# Altium schematic sheet RGBMainBoard - SCH.SchDoc
size A3; SheetNumber: 2; SheetTotal: 9
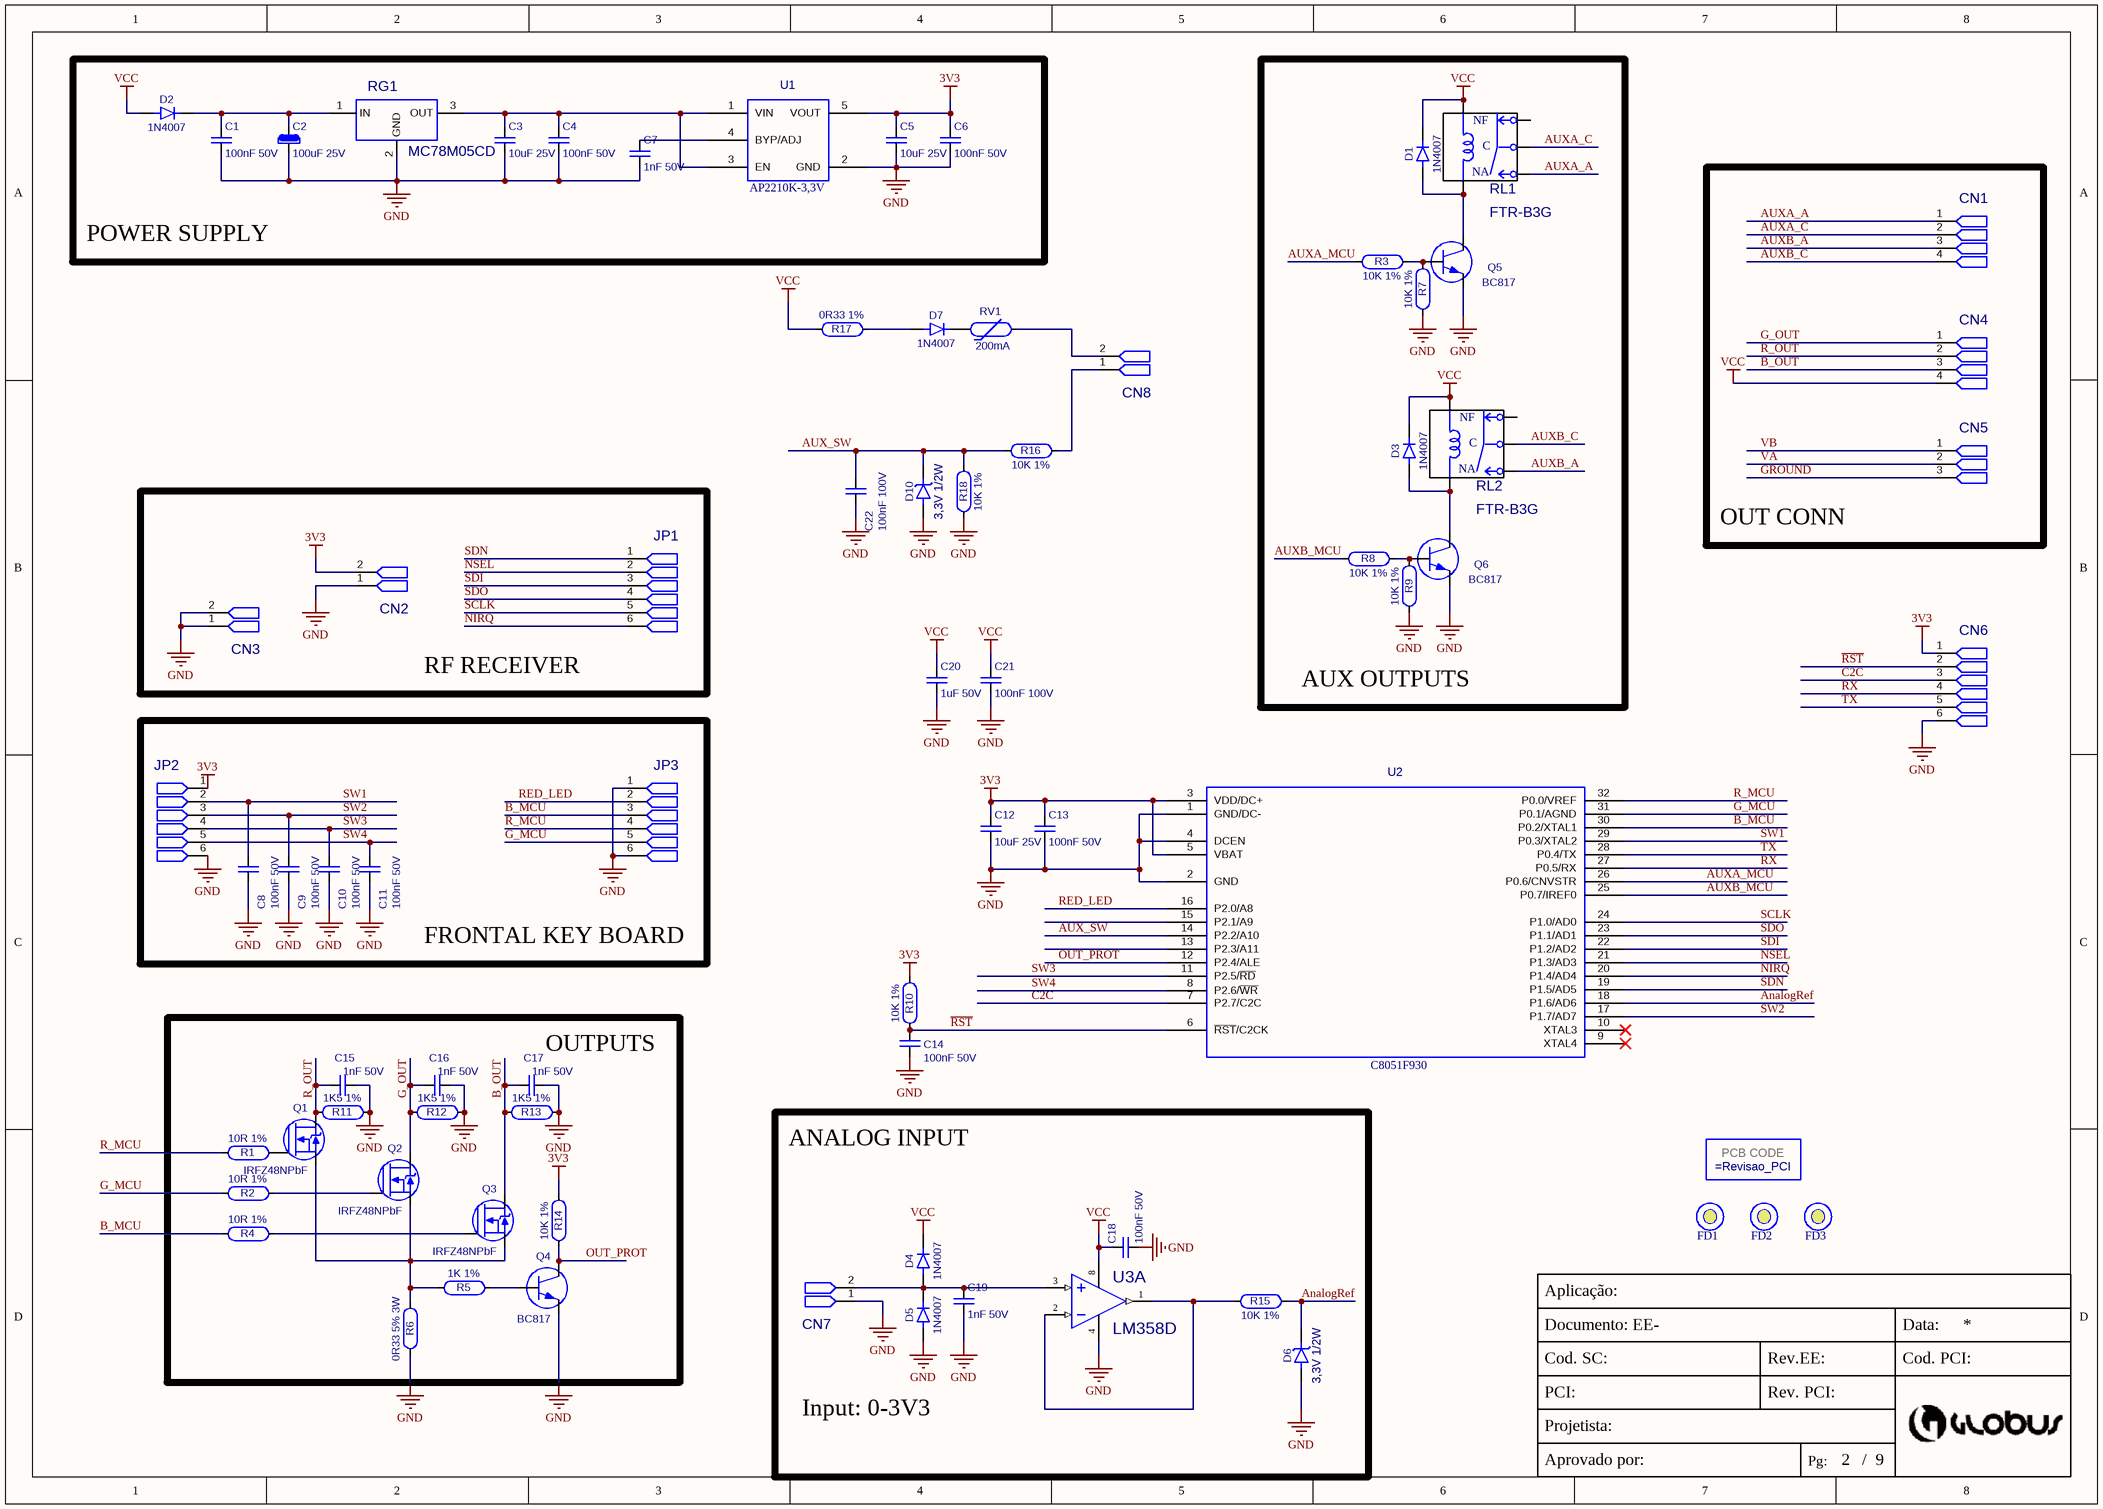
[diagram p0: RGBMainBoard - SCH.SchDoc]

## Parts
=Revisao_PCI  *  [NULL_FOOTPRINT]  (value not drawn)
C1  100nF 50V  [C0805]
C2  100uF 25V  [CAP100P_D6.3H11]
C3  10uF 25V  [C1206]
C4  100nF 50V  [C0805]
C5  10uF 25V  [C1206]
C6  100nF 50V  [C0805]
C7  1nF 50V  [C0805]
C8  100nF 50V  [C0805]
C9  100nF 50V  [C0805]
C10  100nF 50V  [C0805]
C11  100nF 50V  [C0805]
C12  10uF 25V  [C1206]
C13  100nF 50V  [C0805]
C14  100nF 50V  [C0805]
C15  1nF 50V  [C0805]
C16  1nF 50V  [C0805]
C17  1nF 50V  [C0805]
C18  100nF 50V  [C0805]
C19  1nF 50V  [C0805]
C20  1uF 50V  [C0805]
C21  100nF 100V  [C1206]
C22  100nF 100V  [C1206]
CN1  BORNE 4P 5.08  [BORNE 4P 5.08 PTH]  (value not drawn)
CN2  CON BARRA 1x2 180 MACHO PTH  [BARRA2PM180]  (value not drawn)
CN3  CON BARRA 1x2 180 MACHO PTH  [BARRA2PM180]  (value not drawn)
CN4  BORNE 4P 5.08  [BORNE 4P 5.08 PTH]  (value not drawn)
CN5  BORNE 3P 5.08  [BORNE 3P 5.08 PTH]  (value not drawn)
CN6  CON BARRA 1x6 180 MACHO PTH  17mm  [BARRA1x6PM180-17mm]  (value not drawn)
CN7  CON BARRA 1x2 180 MACHO PTH  [BARRA2PM180]  (value not drawn)
CN8  CON BARRA 1x2 180 MACHO PTH  [BARRA2PM180]  (value not drawn)
D1  1N4007  [DO214AC-SMA]
D2  1N4007  [DO214AC-SMA]
D3  1N4007  [DO214AC-SMA]
D4  1N4007  [DO214AC-SMA]
D5  1N4007  [DO214AC-SMA]
D6  3,3V 1/2W  [SOD80-MINIMELF]
D7  1N4007  [DO214AC-SMA]
D10  3,3V 1/2W  [SOD80-MINIMELF]
FD1  Fiducial  [Fiducial]  (value not drawn)
FD2  Fiducial  [Fiducial]  (value not drawn)
FD3  Fiducial  [Fiducial]  (value not drawn)
JP1  CON BARRA 1x6 180 MACHO PTH  [BARRA6PM180]  (value not drawn)
JP2  BARRA6PF180  [BARRA6PF180]  (value not drawn)
JP3  BARRA6PF180  [BARRA6PF180]  (value not drawn)
Q1  IRFZ48NPbF  [TO220AB]
Q2  IRFZ48NPbF  [TO220AB]
Q3  IRFZ48NPbF  [TO220AB]
Q4  BC817  [SOT23]
Q5  BC817  [SOT23]
Q6  BC817  [SOT23]
R1  10R 1%  [R0805]
R2  10R 1%  [R0805]
R3  10K 1%  [R0805]
R4  10R 1%  [R0805]
R5  1K 1%  [R0805]
R6  0R33 5% 3W  [RES2W_L16mm_D5.5]
R7  10K 1%  [R0805]
R8  10K 1%  [R0805]
R9  10K 1%  [R0805]
R10  10K 1%  [R0805]
R11  1K5 1%  [R0805]
R12  1K5 1%  [R0805]
R13  1K5 1%  [R0805]
R14  10K 1%  [R0805]
R15  10K 1%  [R0805]
R16  10K 1%  [R0805]
R17  0R33 1%  [R1206]
R18  10K 1%  [R0805]
RG1  MC78M05CD  [DPAK]
RL1  value FTR-B3G  [RELE_HF3FF-SERIE]  (hidden comment: RELE 12V HF3FF/012-1ZST)
RL2  value FTR-B3G  [RELE_HF3FF-SERIE]  (hidden comment: RELE 12V HF3FF/012-1ZST)
RV1  value 200mA  [PTC5.1_7.4X3.1mm]  (hidden comment: 60R020XU)
U1  AP2210K-3,3V  [SOT23_5]
U2  C8051F930  [LQFP32 7X7]
U3  LM358D  [SO8]  (part A of 2)

## Blocks framed on the sheet
POWER SUPPLY: C1-C7 D2 RG1 U1
AUX OUTPUTS: D1 D3 Q5 Q6 R3 R7-R9 RL1 RL2
OUT CONN: CN1 CN4 CN5
RF RECEIVER: CN2 CN3 JP1
FRONTAL KEY BOARD: C8-C11 JP2 JP3
OUTPUTS: C15-C17 Q1-Q4 R1 R2 R4-R6 R11-R14

## Nets
3V3: C5.1 C6.1 C12.1 C13.1 CN2.2 CN6.1 JP2.1 R10.2 R14.2 U1.5(VOUT) U2.3(VDD/DC+) U2.5(VBAT)
GND: C1.2 C2.1(negative) C3.2 C4.2 C5.2 C6.2 C7.2 C8.2 C9.2 C10.2 C11.2 C12.2 C13.2 C14.2 C15.2 C16.2 C17.2 C18.2 C19.2 C20.2 C21.2 C22.2 CN2.1 CN3.1 CN3.2 CN6.6 CN7.1 D5.1(anode) D6.1(anode) D10.1(anode) JP2.6 JP3.1 JP3.6 Q4.3(E) Q5.3(E) Q6.3(E) R6.1 R7.1 R9.1 R11.2 R12.2 R13.2 R18.2 RG1.2(GND) U1.2(GND) U2.1(GND/DC-) U2.2(GND) U2.4(DCEN) U3.4(GND)
VCC: C18.1 C20.1 C21.1 CN4.4 D1.2(cathode) D2.1(anode) D3.2(cathode) D4.2(cathode) R17.1 RL1.1(B1) RL2.1(B1) U3.8(V+)
AnalogRef: D6.2(cathode) R15.1 U2.18(P1.6/AD6)
AUX_SW: C22.1 D10.2(cathode) R16.2 R18.1 U2.14(P2.2/A10)
AUXA_A: CN1.1 RL1.4(NA)
AUXA_C: CN1.2 RL1.3(C)
AUXA_MCU: R3.2 U2.26(P0.6/CNVSTR)
AUXB_A: CN1.3 RL2.4(NA)
AUXB_C: CN1.4 RL2.3(C)
AUXB_MCU: R8.2 U2.25(P0.7/IREF0)
B_MCU: JP3.3 R4.1 U2.30(P0.2/XTAL1)
B_OUT: C17.1 CN4.3 Q3.2(D) R13.1
C2C: CN6.3 U2.7(P2.7/C2C)
G_MCU: JP3.5 R2.1 U2.31(P0.1/AGND)
G_OUT: C16.1 CN4.1 Q2.2(D) R12.1
GROUND: CN5.3
NIRQ: JP1.6 U2.20(P1.4/AD4)
NSEL: JP1.2 U2.21(P1.3/AD3)
OUT_PROT: Q4.2(C) R14.1 U2.12(P2.4/ALE)
~{RST}: C14.1 CN6.2 R10.1 U2.6(~{RST}/C2CK)
R_MCU: JP3.4 R1.1 U2.32(P0.0/VREF)
R_OUT: C15.1 CN4.2 Q1.2(D) R11.1
RED_LED: JP3.2 U2.16(P2.0/A8)
RX: CN6.4 U2.27(P0.5/RX)
SCLK: JP1.5 U2.24(P1.0/AD0)
SDI: JP1.3 U2.22(P1.2/AD2)
SDN: JP1.1 U2.19(P1.5/AD5)
SDO: JP1.4 U2.23(P1.1/AD1)
SW1: C8.1 JP2.2 U2.29(P0.3/XTAL2)
SW2: C9.1 JP2.3 U2.17(P1.7/AD7)
SW3: C10.1 JP2.4 U2.11(P2.5/~{RD})
SW4: C11.1 JP2.5 U2.8(P2.6/~{WR})
TX: CN6.5 U2.28(P0.4/TX)
VA: CN5.2
VB: CN5.1
NetC1_1: C1.1 C2.2(positive) D2.2(cathode) RG1.1(IN)
NetC3_1: C3.1 C4.1 RG1.3(OUT) U1.1(VIN) U1.3(EN)
NetC7_1: C7.1 U1.4(BYP/ADJ)
NetC19_1: C19.1 CN7.2 D4.1(anode) D5.2(cathode) U3.3(IN+)
NetCN8_1: CN8.1 R16.1
NetCN8_2: CN8.2 RV1.2
NetD1_1: D1.1(anode) Q5.2(C) RL1.2(B2)
NetD3_1: D3.1(anode) Q6.2(C) RL2.2(B2)
NetD7_1: D7.1(anode) R17.2
NetD7_2: D7.2(cathode) RV1.1
NetQ1_1: Q1.1(G) R1.2
NetQ1_3: Q1.3(S) Q2.3(S) Q3.3(S) R5.1 R6.2
NetQ2_1: Q2.1(G) R2.2
NetQ3_1: Q3.1(G) R4.2
NetQ4_1: Q4.1(B) R5.2
NetQ5_1: Q5.1(B) R3.1 R7.2
NetQ6_1: Q6.1(B) R8.1 R9.2
NetR15_2: R15.2 U3.1(OUT) U3.2(IN-)

Not connected (* = marked no-connect by the designer): RL1 5(NF); RL2 5(NF); U2 9(XTAL4)* 10(XTAL3)* 13(P2.3/A11) 15(P2.1/A9)

## Notes on the sheet
- ANALOG INPUT
- Input: 0-3V3
- Aplicação:
- Cod. SC:
- PCI:
- Documento: EE-
- Rev. PCI:
- Rev.EE:
- Data:
- Cod. PCI:
- Projetista:
- Aprovado por:
- Pg:
- /
- (in symbol CODIGO PCI) PCB CODE

## Library data of the parts
=Revisao_PCI = CODIGO PCI: Preencher com o código da placa. Irá aparecer na serigrafia.; REFERENCIA: =Revisao_PCI; ENCAPSULAMENTO: *; ModifyDate: 16/08/2016 11:46:26; Value: *
C1 C4 C6 C8-C11 C13 C14 C18 = CC 100nF 50V 0805: REFERENCIA: 003.05.002; ENCAPSULAMENTO: C0805; ModifyDate: 05/27/2015 14:07:26; Value: 100nF 50V
C2 = CE 100uF 25V PTH: C.Elet.1000uF 25V 20% Radial; ENCAPSULAMENTO: PTH; Part Number: *; REFERENCIA: 003.50.001; ModifyDate: 05/27/2015 14:07:26; Value: 100uF 25V
C3 C5 C12 = CC 10uF 25V 1206: REFERENCIA: 003.10.004; ENCAPSULAMENTO: C1206; ModifyDate: 05/27/2015 14:07:26; Value: 10uF 25V
C7 C15-C17 C19 = CC 1nF 50V 0805: REFERENCIA: 003.05.006; ENCAPSULAMENTO: C0805; ModifyDate: 05/27/2015 14:07:26; Value: 1nF 50V
C20 = CC 1uF 50V 0805: REFERENCIA: 003.05.015; ENCAPSULAMENTO: C0805; ModifyDate: 01/08/2016 08:47:26; Value: 1uF 50V
C21 C22 = CC 100nF 100V 1206: REFERENCIA: 003.10.006; ENCAPSULAMENTO: C1206; ModifyDate: 05/27/2015 14:07:26; Value: 100nF 100V
CN1 CN4 = CON BORNE 4P 5.08 PTH: Part Number: BR8MN2-04; REFERENCIA: *; ENCAPSULAMENTO: *; ModifyDate: ????; Value: *
CN2 CN3 CN7 CN8 = CON BARRA 1x2 180 MACHO PTH: Barra de pinos simples 1x2 180g. 2,54mm; Part Number: {Part Number}; Value: BARRA2PM180; REFERENCIA: 052.01.014; ENCAPSULAMENTO: PTH; ModifyDate: 05/27/2015 14:07:26
CN5 = CON BORNE 3P 5.08 PTH: Part Number: BR8MN2-03; REFERENCIA: *; ENCAPSULAMENTO: *; ModifyDate: ????; Value: *
CN6 = CON BARRA 1x6 180 MACHO PTH  17mm: Barra de pinos simples 1x6 180g. 2,54mm; Part Number: {Part Number}; Value: BARRA1x6PM180-17mm; REFERENCIA: 052.01.027; ENCAPSULAMENTO: PTH; ModifyDate: 05/27/2015 14:07:26
D1-D5 D7 = D 1N4007 SMD: Diodo 1N4007 (S1M-E3/5AT) DO214AC/SMA; REFERENCIA: 005.00.001; ENCAPSULAMENTO: DO214AC-SMA; ModifyDate: 05/27/2015 14:07:26; Value: 1N4007
D6 D10 = DZ 3,3V 1/2W MINIMELF: Zener 3,3V 1/2W MINIMELF; REFERENCIA: 005.10.015; ENCAPSULAMENTO: MINIMELF; ModifyDate: 05/27/2015 14:07:26; Value: 3,3V 1/2W
JP1 = CON BARRA 1x6 180 MACHO PTH: Barra de pinos simples 1x6 180g. 2,54mm; Part Number: {Part Number}; Value: BARRA6PM180; REFERENCIA: 052.01.014; ENCAPSULAMENTO: PTH; ModifyDate: 05/27/2015 14:07:26
JP2 JP3 = CON BARRA 1X6 180 FEMEA PTH: Barra de pinos simples 1x6 180g. 2,54mm; Part Number: {Part Number}; ENCAPSULAMENTO: PTH; REFERENCIA: 052.01.020; ModifyDate: 05/27/2015 14:07:26; Value: BARRA6PF180
Q1-Q3 = TRAN CANAL N IRFZ48NPbF TO220: REFERENCIA: ???; Part Number: IRFZ48NPbF; ENCAPSULAMENTO: TO220; ModifyDate: ????; Value: IRFZ48NPbF
Q4-Q6 = TRAN NPN BC817 SOT-23-3: SMT NPN 45V 0.5A SOT23 General Purpose Transistor; ENCAPSULAMENTO: SOT23-3; Part Number: *; REFERENCIA: 008.00.002; ModifyDate: 05/27/2015 14:07:26; Value: BC817
R1 R2 R4 = RES 10R 1% 0805: Part Number: {Part Number}; REFERENCIA: 002.05.005; ENCAPSULAMENTO: R0805; ModifyDate: 05/27/2015 14:07:26; Value: 10R 1%
R3 R7-R10 R14-R16 R18 = RES 10K 1% 0805: Part Number: {Part Number}; REFERENCIA: 002.05.004; ENCAPSULAMENTO: R0805; ModifyDate: 05/27/2015 14:07:26; Value: 10K 1%
R5 = RES 1K 1% 0805: Part Number: {Part Number}; REFERENCIA: 002.05.009; ENCAPSULAMENTO: R0805; ModifyDate: 05/27/2015 14:07:26; Value: 1K 1%
R6 = RES 0R33 5% 3W PTH: Part Number: AC03000003307JAC00; REFERENCIA: ???; ENCAPSULAMENTO: RES PTH; ModifyDate: ???; Value: 0R33 5% 3W
R11-R13 = RES 1K5 1% 0805: Part Number: {Part Number}; REFERENCIA: 002.05.011; ENCAPSULAMENTO: R0805; ModifyDate: 05/27/2015 14:07:26; Value: 1K5 1%
R17 = RES 0R33 1% 1206: Part Number: {Part Number}; REFERENCIA: 002.10.003; ENCAPSULAMENTO: R1206; ModifyDate: 05/27/2015 14:07:26; Value: 0R33 1%
RG1 = CI REG LIN 5V MC78M05CD DPAK: 5V 1A DPAK-3 3 Terminal  Positive Voltage Regulator; Part Number: *; REFERENCIA: 001.10.010; ENCAPSULAMENTO: DPAK; ModifyDate: 05/27/2015 14:07:27; Value: MC78M05CD
RL1 RL2 = RELE 12V HF3FF/012-1ZST: REFERENCIA: ?????; ENCAPSULAMENTO: PTH; Part Number: HF3FF/012-1ZST; ModifyDate: ?????
RV1 = R POLYSWITCH 60R020XU: R POLYSWITCH 60R020XU PTH; REFERENCIA: 002.75.001; ENCAPSULAMENTO: PTH; ModifyDate: 22/09/2016 14:07:26; Part Number: 60R020XU
U1 = CI REG LDO 3,3V AP2210K: AP2210 300mA RF ULDO REGLATOR SOT23-5; REFERENCIA: 001.10.008; ENCAPSULAMENTO: SOT23-5; ModifyDate: 05/27/2015 14:07:27; Value: AP2210K-3,3V
U2 = CI PROC C8051F930 LQFP32: C8051F930 LQFP32; Part Number: C8051F930-G-GQ; REFERENCIA: ?????; ENCAPSULAMENTO: LQFP32; ModifyDate: 05/27/2015 14:07:27; Value: C8051F930
U3 = CI LM358D SO8: Low Power Dual Operational Amplifier SMT SO8; Value: LM358; Part Number: *; REFERENCIA: 001.45.001; ENCAPSULAMENTO: SO8; ModifyDate: 05/27/2015 14:07:26